# Altium schematic sheet Controller.SchDoc
size A4
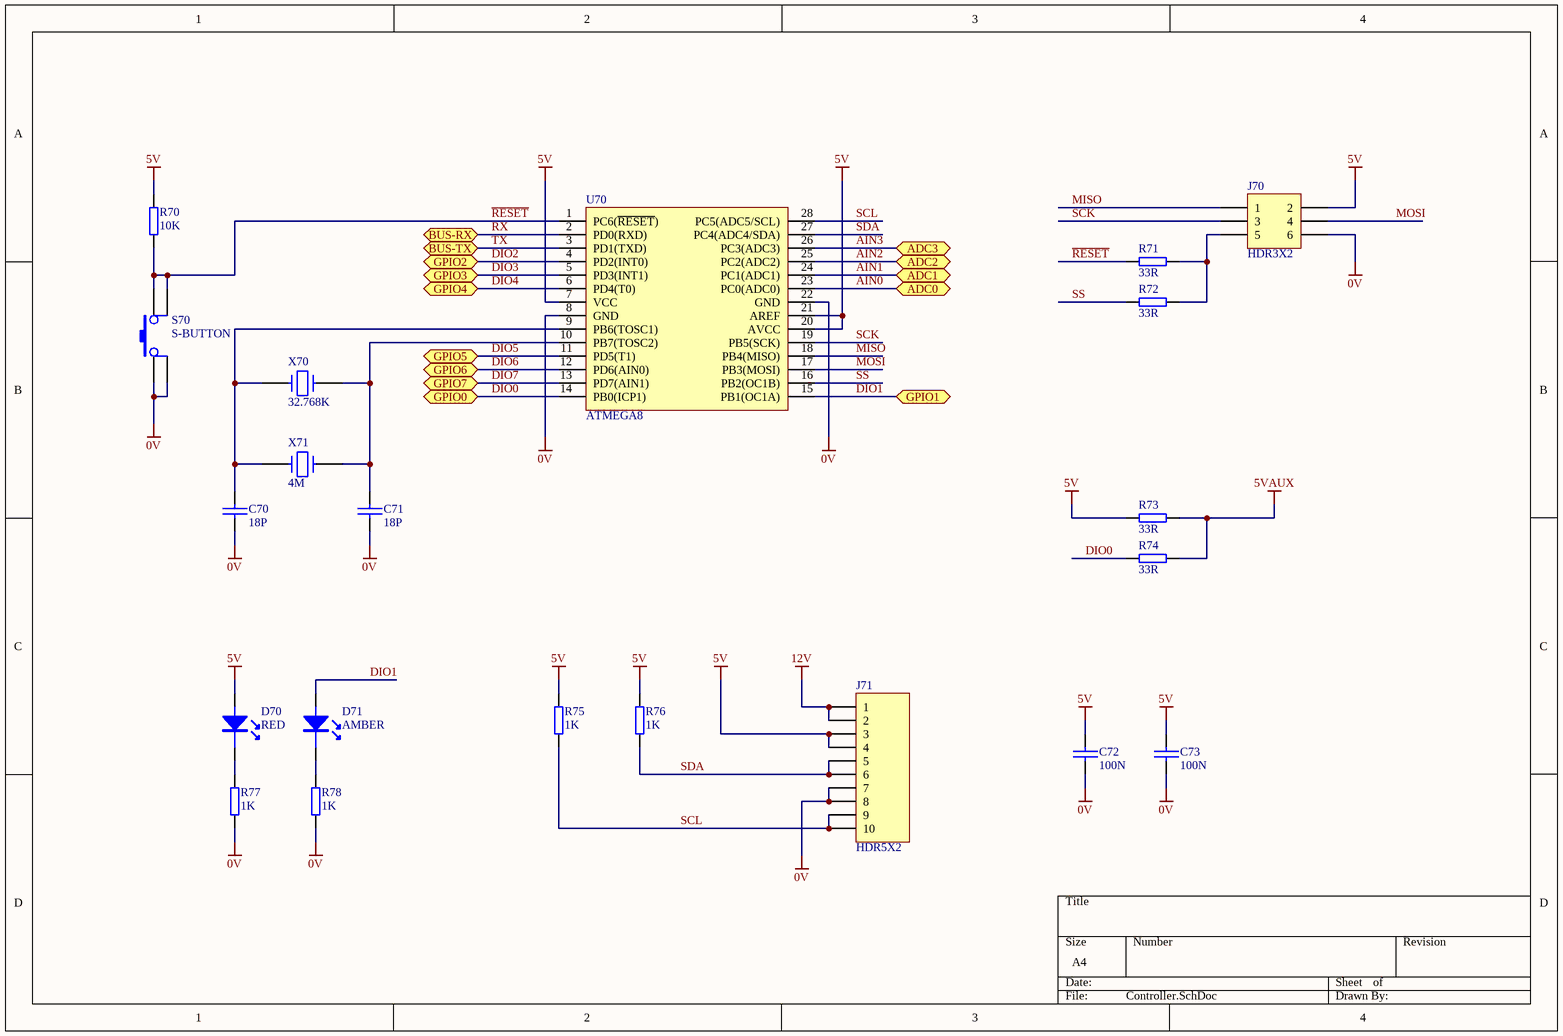
[diagram p0: Controller.SchDoc]

## Parts
C70  18P  [AXIAL02]
C71  18P  [AXIAL02]
C72  100N  [AXIAL02]
C73  100N  [AXIAL02]
D70  RED  [LED5MM]
D71  AMBER  [LED5MM]
J70  HDR3X2  [HDR3X2]
J71  HDR5X2  [HDR5X2]
R70  10K  [AXIAL04]
R71  33R  [AXIAL04]
R72  33R  [AXIAL04]
R73  33R  [AXIAL04]
R74  33R  [AXIAL04]
R75  1K  [AXIAL04]
R76  1K  [AXIAL04]
R77  1K  [AXIAL04]
R78  1K  [AXIAL04]
S70  S-BUTTON  [SWPB]
U70  ATMEGA8  [DIP28N]
X70  32.768K  [RADIAL01]
X71  4M  [HC49]

## Ports
ADC0, ADC1, ADC2, ADC3, BUS-RX, BUS-TX, GPIO0, GPIO1, GPIO2, GPIO3, GPIO4, GPIO5, GPIO6, GPIO7

## Nets
0V: C70.2 C71.2 C72.2 C73.2 J70.6 J71.7 J71.8 R77.1 R78.1 S70.1 S70.3 U70.8(GND) U70.22(GND)
5V: C72.1 C73.1 D70.1(A) J70.2 J71.3 J71.4 R70.2 R73.2 R75.2 R76.2 U70.7(VCC) U70.20(AVCC) U70.21(AREF)
5VAUX: R73.1 R74.1
12V: J71.1 J71.2
AIN0: U70.23(PC0(ADC0)) ; port ADC0
AIN1: U70.24(PC1(ADC1)) ; port ADC1
AIN2: U70.25(PC2(ADC2)) ; port ADC2
AIN3: U70.26(PC3(ADC3)) ; port ADC3
DIO0: R74.2 U70.14(PB0(ICP1)) ; port GPIO0
DIO1: D71.1(A) U70.15(PB1(OC1A)) ; port GPIO1
DIO2: U70.4(PD2(INT0)) ; port GPIO2
DIO3: U70.5(PD3(INT1)) ; port GPIO3
DIO4: U70.6(PD4(T0)) ; port GPIO4
DIO5: U70.11(PD5(T1)) ; port GPIO5
DIO6: U70.12(PD6(AIN0)) ; port GPIO6
DIO7: U70.13(PD7(AIN1)) ; port GPIO7
MISO: J70.1 U70.18(PB4(MISO))
MOSI: J70.4 U70.17(PB3(MOSI))
~{RESET}: R70.1 R71.1 S70.2 S70.4 U70.1(PC6(~{RESET}))
RX: U70.2(PD0(RXD)) ; port BUS-RX
SCK: J70.3 U70.19(PB5(SCK))
SCL: J71.9 J71.10 R75.1 U70.28(PC5(ADC5/SCL))
SDA: J71.5 J71.6 R76.1 U70.27(PC4(ADC4/SDA))
SS: R72.1 U70.16(PB2(OC1B))
TX: U70.3(PD1(TXD)) ; port BUS-TX
NetC70_1: C70.1 U70.9(PB6(TOSC1)) X70.1 X71.1
NetC71_1: C71.1 U70.10(PB7(TOSC2)) X70.2 X71.2
NetD70_2: D70.2(K) R77.2
NetD71_2: D71.2(K) R78.2
NetJ70_5: J70.5 R71.2 R72.2

## Library data of the parts
C70 C71 = C-B18P: CAPACITOR
C72 C73 = C-B100N: CAPACITOR
D70 = O-RED: LED
D71 = O-AMBER: LED
J70 = J-HDR3X2: CONNECTOR
J71 = J-HDR5X2A: CONNECTOR
R70 = R-A10K: RESISTOR; Detail: *; Order: *; Cost: *
R71-R74 = R-A33R: RESISTOR; Detail: *; Order: *; Cost: *
R75-R78 = R-A1K: RESISTOR; Detail: *; Order: *; Cost: *
S70 = S-BUTTON: PUSH BUTTON SWITCH
U70 = U-ATMEGA8: MICROCONTROLLER
X70 = X-32K768: CRYSTAL
X71 = X-4M: CRYSTAL